# EAGLE design G1Tech-BME680_r1 (EAGLE 9.0.0)
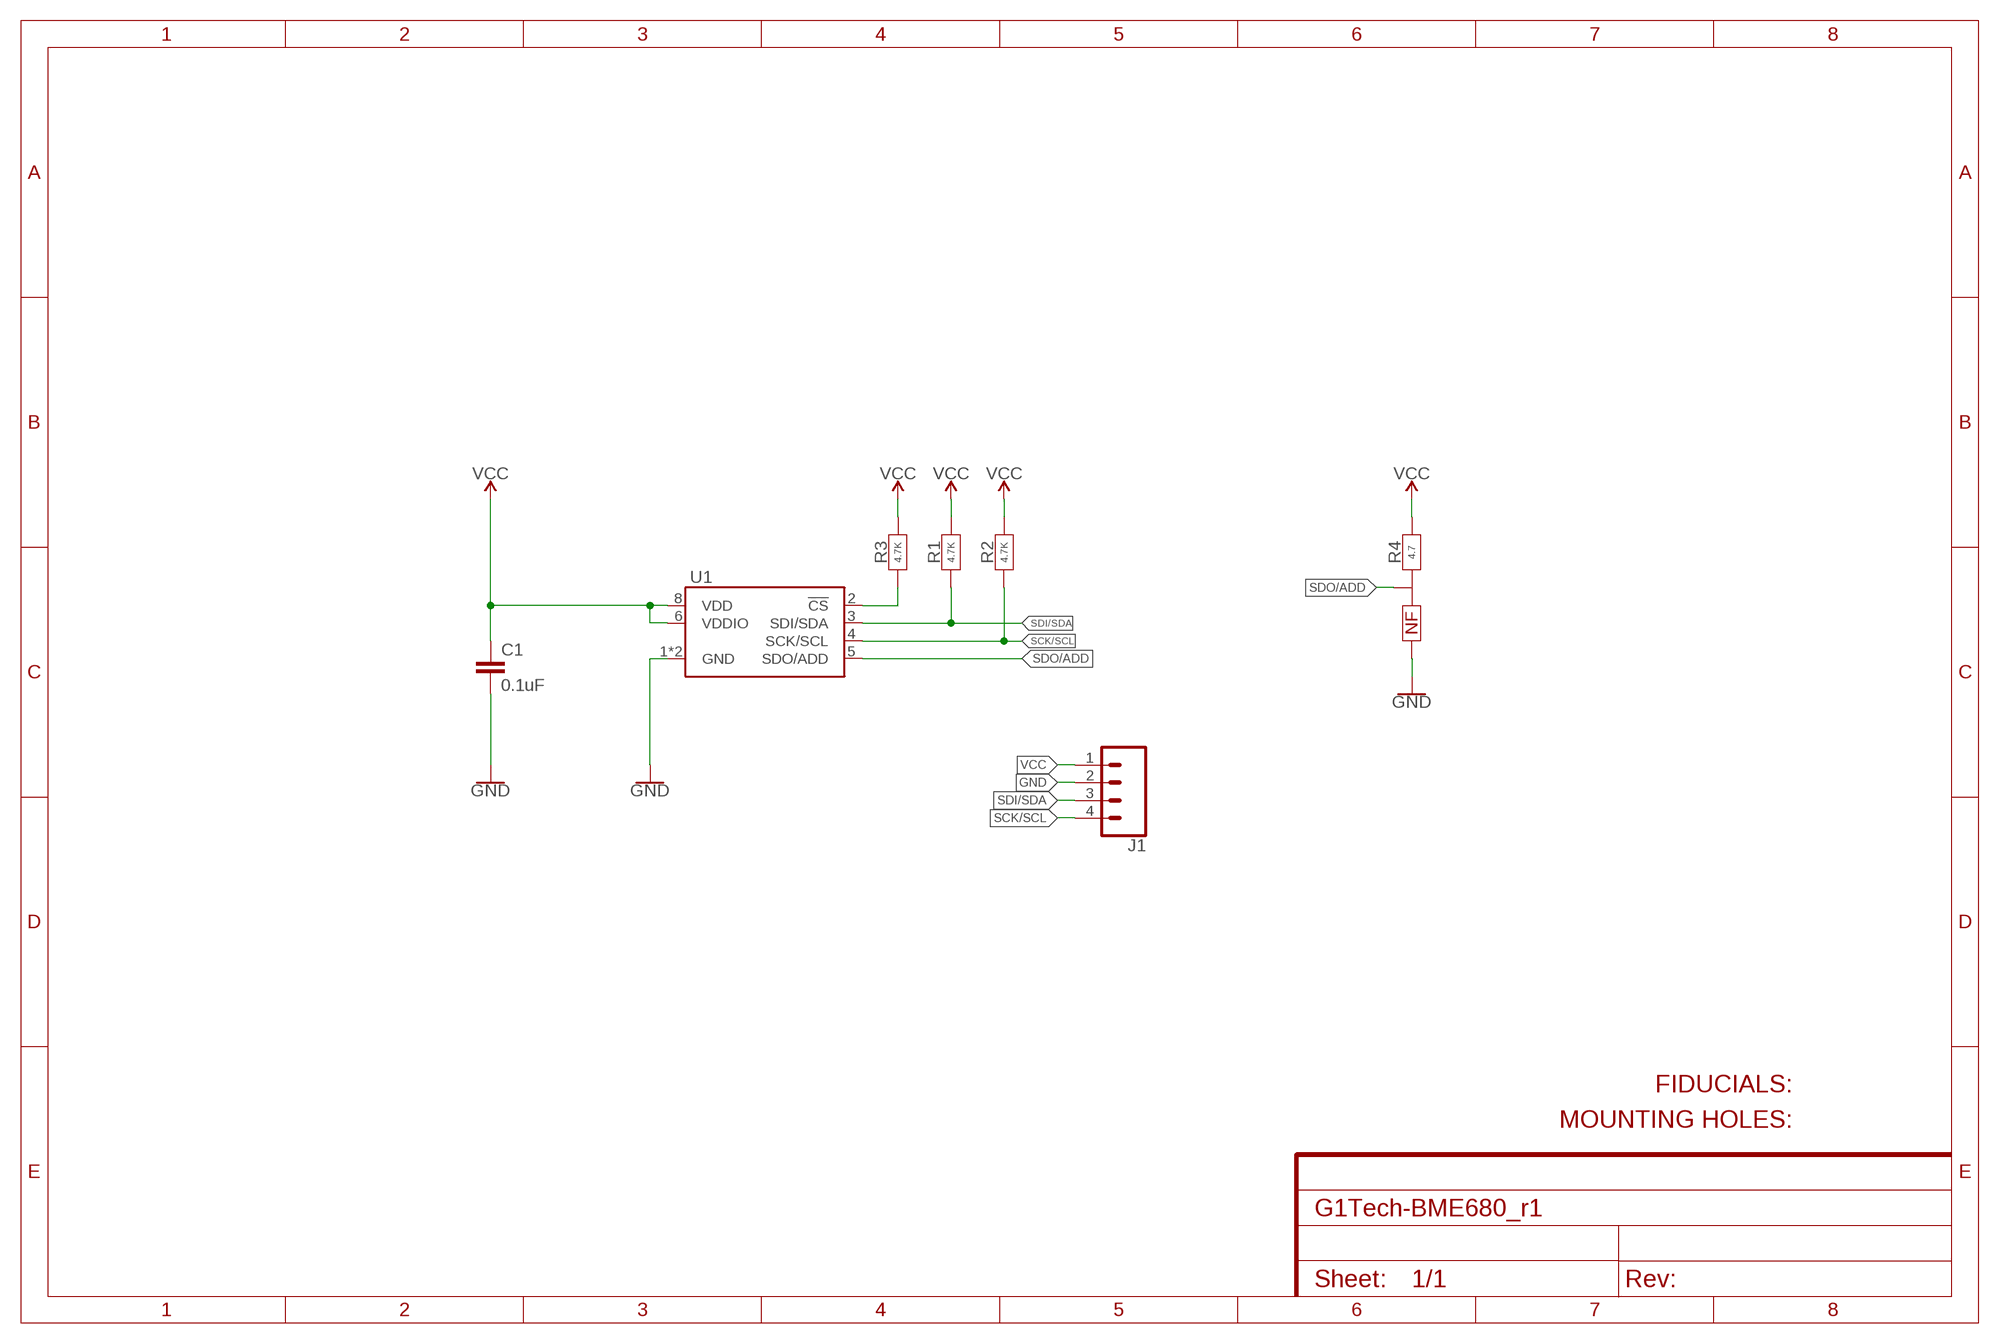
[diagram p0: schematic, sheet 1]

## Parts
C1  0.1uF  TDK-C0603  [TDK-C0603]
J1  CONN_04  [1X04]
R1  4.7K  YAGEO-R0603  [YAGEO-R0603]
R2  4.7K  YAGEO-R0603  [YAGEO-R0603]
R3  4.7K  YAGEO-R0603  [YAGEO-R0603]
R4  4.7  JUMPER-0R-UPJP0603-YAGEO  [YAGEO-JP0603]
U1  BOSH-BME680  [BOSH-BME680]

## Nets
!CS: R3.1 U1.2(!CS)
GND: C1.2 J1.2 R4.3 U1.1(GND) U1.7(GND)
SCK/SCL: J1.4 R2.1 U1.4(SCK/SCL)
SDI/SDA: J1.3 R1.1 U1.3(SDI/SDA)
SDO/ADD: R4.2 U1.5(SDO/ADD)
VCC: C1.1 J1.1 R1.2 R2.2 R3.2 R4.1 U1.6(VDDIO) U1.8(VDD)

## Library data of the parts
C1 = G1Tech-Components:TDK-C0603
J1 = SparkFun-Connectors:CONN_04: Multi connection point. Often used as Generic Header-pin footprint for 0.1 inch spaced/style header connections On any of the 0.1 inch spaced packages, you can populate with these: Break Away Headers - Straight <https://www.sparkfun.com/products/116> (PRT-00116) Break Away Male Headers - Right Angle <https://www.sparkfun.com/products/553> (PRT-00553) Female Headers <https://www.sparkfun.com/products/115> (PRT-00115) Break Away Headers - Machine Pin <https://www.sparkfun.com/products/117> (PRT-00117) Break Away Female Headers - Swiss Machine Pin <https://www.sparkfun.com/products/743> (PRT-00743) For SCREWTERMINALS and SPRING TERMINALS visit here: Screw Terimnals on SparkFun.com <https://www.sparkfun.com/search/results?term=Screw+Terminals> (5mm/3.5mm/2.54mm spacing) This device is also useful as a general connection point to wire up your design to another part of your project. Our various solder wires solder well into these plated through hole pads. Hook-Up Wire - Assortment (Stranded, 22 AWG) <https://www.sparkfun.com/products/11375> (PRT-11375) Hook-Up Wire - Assortment (Solid Core, 22 AWG) <https://www.sparkfun.com/products/11367> (PRT-11367) View the entire wire category on our website here <https://www.sparkfun.com/categories/141> Special notes: Molex polarized connector foot print use with SKU : PRT-08231 with associated crimp pins and housings. 1MM SMD Version SKU: PRT-10208; PROD_ID: CONN-09696
R1-R3 = G1Tech-Components:YAGEO-R0603: YAGEO Resistor R0603
R4 = G1Tech-Components:JUMPER-0R-UP
U1 = G1Tech-Components:BOSH-BME680

## Board
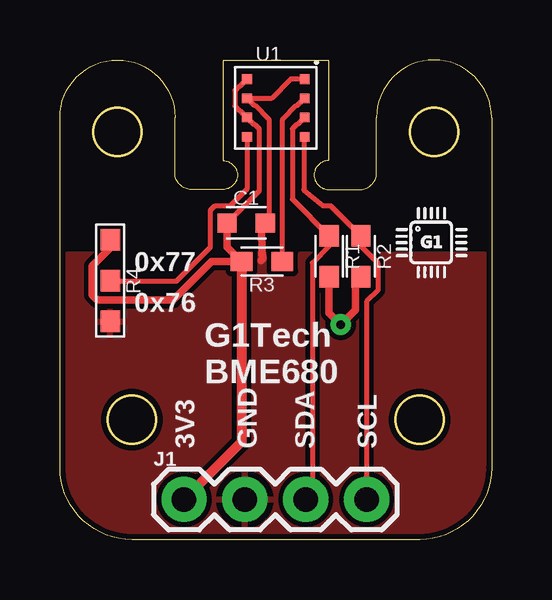
[diagram p1: board, top side]
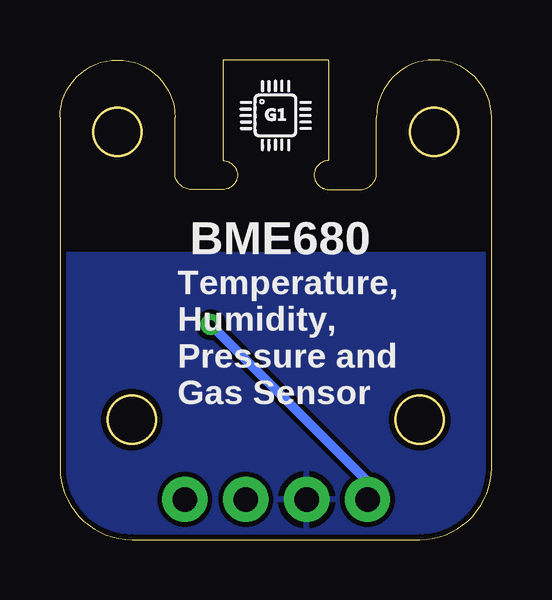
[diagram p2: board, bottom side, seen from below]

Size 18 x 20 mm. Coordinates in mm from the lower left corner, seen from the top.
Outline: 0,3 0,17.6 arc-180 4.8,17.6 4.8,15.2 arc74 5.4,14.6 6.8,14.6 arc180 6.8,15.8 6.8,20 11.2,20 11.2,15.8 arc180 11.2,14.6 12.6,14.6 arc74 13.2,15.2 13.2,17.6 arc-180 18,17.6 18,3 arc-90 15,0 3,0 arc-90 0,3
Outline: circle at 3,5 radius 1
Outline: circle at 15,5 radius 1
Outline: circle at 2.4,17 radius 1
Outline: circle at 15.6,17 radius 1
Copper layers (1*16): Top 0.035mm / dielectric 1.5mm / Bottom 0.035mm
Design rules "SparkFun": minimum track width 8mil, minimum drill 20mil, track to track 8mil, track to pad 8mil, pad to pad 8mil, via to via 8mil, smd to smd 8mil, copper to edge 9mil, drill to drill 8mil, minimum pad ring 12mil, minimum via ring 10mil, stop-mask expansion 4mil, vias tented up to drill 20mil, thermal gap 10mil

### Footprints (pad centres in the part's own frame; a part is rotated, then mirrored left to right if it is on the bottom)
TDK-C0603 = smd 0.8 x 0.8: 1 -0.8,0; 2 0.8,0
1X04 = drill 1.016 pad 1.88: 1 0,0; 2 2.54,0; 3 5.08,0; 4 7.62,0
YAGEO-R0603 = smd 0.9 x 0.8: 1 -0.85,0; 2 0.85,0
YAGEO-JP0603 = smd 0.9 x 0.8: 1 -1.7,0; 2 0,0; 3 1.7,0
BOSH-BME680 = smd 0.4 x 0.4: 1 1.2,1.2; 2 1.2,0.4; 3 1.2,-0.4; 4 1.2,-1.2; 5 -1.2,-1.2; 6 -1.2,-0.4; 7 -1.2,0.4; 8 -1.2,1.2

### Placement (x,y rotation side)
C1  7.77,13.2 0 top
J1  5.17,1.67 0 top
R1  11.23,11.81 270 top
R2  12.55,11.81 270 top
R3  8.42,11.6 180 top
R4  2.1,10.8 270 top
U1  9,18 0 top
U$1  [LOGO-G1TECH-3MM]  14,10.9 0 top
U$2  [LOGO-G1TECH-3MM]  10.5,16.2 0 bottom

### Tracks (layer width: path | path; a pad name or v marks a point on that pad's centre or on a via)
!CS
  Top 0.203: U1.2 9.9,18.11 9.87,18.11 9.28,17.51 R3.1
GND
  Top 0.203: U1.1 9.62,19.2 8.81,18.39 U1.7 8.1,18.11 8.13,18.11 8.72,17.51 8.72,13.36 C1.2
  Top 0.305: C1.2 8.41,13 8.42,11.92 8.47,11.72 8.38,11.63
  pour Top: 0,0 0,12 18,12 18,0
  pour Bottom: 0,0 0,12 18,12 18,0
SCK/SCL
  Top 0.203: U1.4 10.17,16.7 10.17,14.58 10.96,13.92 11.29,13.92 R2.1 12.55,12.24 13.25,11.54 13.25,10.38 12.79,9.92 J1.4
SDI/SDA
  Top 0.203: U1.3 9.9,17.3 9.87,17.3 9.7,17.13 9.7,14.19 R1.1 11.23,12.24 10.52,11.54 10.52,1.94 J1.3
SDO/ADD
  Top 0.203: U1.5 7.8,14.61 7.1,13.91 6.44,13.91 6.26,13.73 6.26,12.18 4.85,10.77 2.13,10.77 R4.2
VCC  (via drill 0.36)
  Top 0.203: U1.8 7.5,18.91 7.47,18.91 7.29,18.73 7.29,18.07 7.47,17.89 7.5,17.89 U1.6 8.1,17.3 8.13,17.3 8.3,17.13 8.3,14.54 C1.1
  Top 0.305: C1.1 6.97,12.21 R3.2 6.33,11.6 4.72,9.99 1.55,9.99 1.34,10.2 1.34,11.4 2.1,12.15 R4.1 | R1.2 11.23,9.45 v11.71,8.97 12.32,9.58 12.32,10.73 R2.2
  Top 0.406: R3.2 7.58,4.08 J1.1
  Bottom 0.305: 5.17,2.43 J1.1
  Bottom 0.406: v11.71,8.97 5.17,2.43

### Text on the board
tPlace: 0x77 | 0x76 | G1Tech / BME680 | 3V3 | GND | SDA | SCL
bPlace: BME680 | Temperature, / Humidity, / Pressure and / Gas Sensor